# Altium schematic sheet cpu_board.SchDoc
size A3
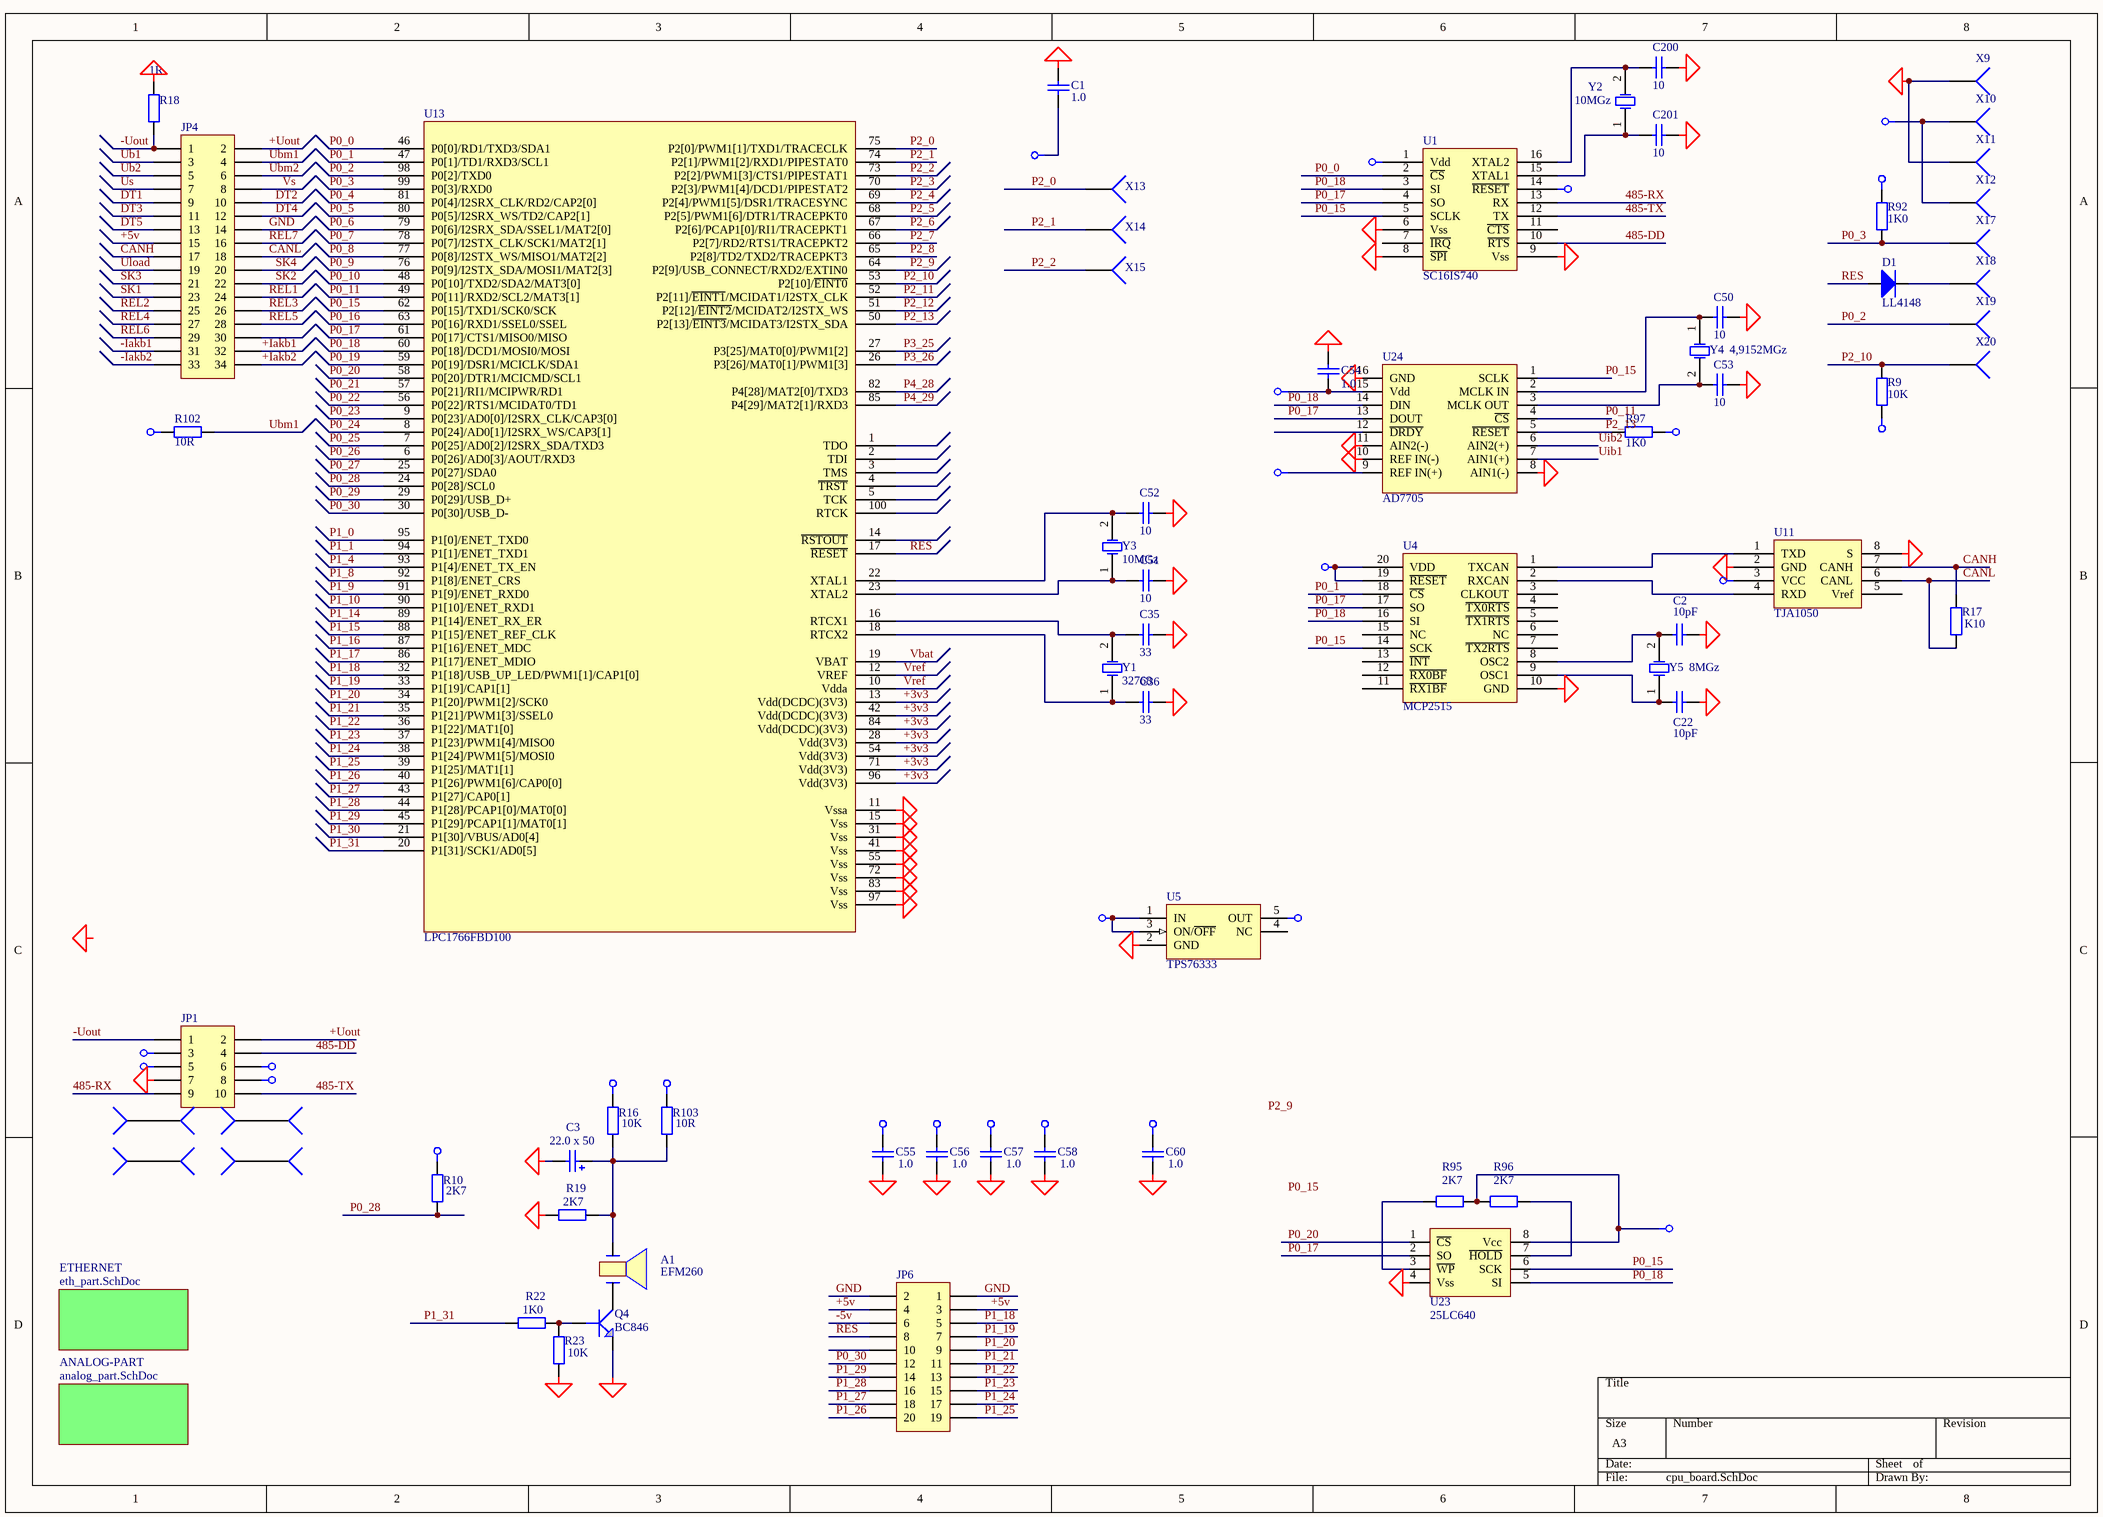
[diagram p0: cpu_board.SchDoc]

## Parts
A1  EFM260  [Pjezo15]
C1  1.0  [_1206]
C2  value 10pF  [_1206]  (hidden comment: Cap Semi)
C3  22.0 x 50  [el3]
C22  value 10pF  [_1206]  (hidden comment: Cap Semi)
C35  33  [_1206]
C36  33  [_1206]
C50  10  [_1206]
C51  10  [_1206]
C52  10  [_1206]
C53  10  [_1206]
C54  1.0  [_1206]
C55  1.0  [_1206]
C56  1.0  [_1206]
C57  1.0  [_1206]
C58  1.0  [_1206]
C60  1.0  [_1206]
C200  10  [_1206]
C201  10  [_1206]
D1  LL4148  [_1206d]
JP1  PBD-10  [HDR2X5]  (value not drawn)
JP4  IDC34  [IDC34M]  (value not drawn)
JP6  PBD-20  [HDR2X10]  (value not drawn)
Q4  BC846  [SO-G3]
R9  10K  [_1206]
R10  2K7  [_1206]
R16  10K  [_1206]
R17  K10  [_1206]
R18  1R  [_1206]
R19  2K7  [_1206]
R22  1K0  [_1206]
R23  10K  [_1206]
R92  1K0  [_1206]
R95  2K7  [_1206]
R96  2K7  [_1206]
R97  1K0  [_1206]
R102  10R  [_1206]
R103  10R  [_1206]
U1  SC16IS740  [TSSO5X6-G16]
U4  MCP2515  [TSSO6X6-G20/D6.6]
U5  TPS76333  [SO-G5/P.95]
U11  TJA1050  [SO-G8/D5]
U13  LPC1766FBD100  [LPC2368]
U23  25LC640  [SO-G8/D5]
U24  AD7705  [SO-G16/D10.4]
X9  (no value)  [PIN1]
X10  (no value)  [PIN1]
X11  (no value)  [PIN1]
X12  (no value)  [PIN1]
X13  (no value)  [PIN1]
X14  (no value)  [PIN1]
X15  (no value)  [PIN1]
X16  (no value)  [PIN1]
X17  (no value)  [PIN1]
X18  (no value)  [PIN1]
X19  (no value)  [PIN1]
X20  (no value)  [PIN1]
X21  (no value)  [PIN1]
X22  (no value)  [PIN1]
X23  (no value)  [PIN1]
X24  (no value)  [PIN1]
X25  (no value)  [PIN1]
X26  (no value)  [PIN1]
X27  (no value)  [PIN1]
Y1  32768  [QWARZ2]
Y2  10MGz  [QWARZ1]
Y3  10MGz  [QWARZ1]
Y4  4,9152MGz  [QWARZ1]
Y5  8MGz  [QWARZ1]

## Sub-sheets
ANALOG-PART = analog_part.SchDoc: no entries
ETHERNET = eth_part.SchDoc: no entries

## Nets
+3v3: C1.1 C58.2 JP1.3 R9.1 R10.2 R92.2 U13.13(Vdd(DCDC)(3V3)) U13.28(Vdd(3V3)) U13.42(Vdd(DCDC)(3V3)) U13.54(Vdd(3V3)) U13.71(Vdd(3V3)) U13.84(Vdd(DCDC)(3V3)) U13.96(Vdd(3V3))
+5v: C54.2 C55.2 C57.2 C60.2 JP1.5 JP4.15 JP6.3 JP6.4 R95.2 R96.1 R97.2 R103.2 U1.1(Vdd) U1.14(~{RESET}) U4.19(~{RESET}) U4.20(VDD) U5.1(IN) U5.3(ON/~{OFF}) U11.3(VCC) U23.8(Vcc) U24.15(Vdd) X10.1 X12.1
+Uout: JP1.2 JP4.2 R16.2 R102.2
-5v: C56.2 JP1.8 JP6.6
GND: C1.2 C2.1 C3.2 C22.1 C35.1 C36.1 C50.1 C51.1 C52.1 C53.1 C54.1 C55.1 C56.1 C57.1 C58.1 C60.1 C200.1 C201.1 JP1.7 JP4.14 JP6.1 JP6.2 Q4.2(E) R18.2 R19.1 R23.1 U1.6(Vss) U1.8(~{SPI}) U1.9(Vss) U4.10(GND) U5.2(GND) U11.2(GND) U11.8(S) U13.11(Vssa) U13.15(Vss) U13.31(Vss) U13.41(Vss) U13.55(Vss) U13.72(Vss) U13.83(Vss) U13.97(Vss) U23.4(Vss) U24.8(AIN1(-)) U24.10(REF_IN(-)) U24.11(AIN2(-)) U24.16(GND) X9.1 X11.1
Vbat: JP1.6 U13.19(VBAT)
Vref: U5.5(OUT) U13.10(Vdda) U13.12(VREF) U24.9(REF_IN(+))
485-DD: JP1.4 U1.10(~{RTS})
485-RX: JP1.9 U1.13(RX)
485-TX: JP1.10 U1.12(TX)
+Iakb1: JP4.32
+Iakb2: JP4.34
-Iakb1: JP4.31
-Iakb2: JP4.33
-Uout: JP1.1 JP4.1 R18.1
CANH: JP4.17 R17.2 U11.7(CANH)
CANL: JP4.18 R17.1 U11.6(CANL)
DT1: JP4.9
DT2: JP4.10
DT3: JP4.11
DT4: JP4.12
DT5: JP4.13
P0_0: U1.2(~{CS}) U13.46(P0[0]/RD1/TXD3/SDA1)
P0_1: U4.18(~{CS}) U13.47(P0[1]/TD1/RXD3/SCL1)
P0_2: U13.98(P0[2]/TXD0) X19.1
P0_3: R92.1 U13.99(P0[3]/RXD0) X17.1
P0_4: U13.81(P0[4]/I2SRX_CLK/RD2/CAP2[0])
P0_5: U13.80(P0[5]/I2SRX_WS/TD2/CAP2[1])
P0_6: U13.79(P0[6]/I2SRX_SDA/SSEL1/MAT2[0])
P0_7: U13.78(P0[7]/I2STX_CLK/SCK1/MAT2[1])
P0_8: U13.77(P0[8]/I2STX_WS/MISO1/MAT2[2])
P0_9: U13.76(P0[9]/I2STX_SDA/MOSI1/MAT2[3])
P0_10: U13.48(P0[10]/TXD2/SDA2/MAT3[0])
P0_11: U13.49(P0[11]/RXD2/SCL2/MAT3[1]) U24.4(~{CS})
P0_15: U1.5(SCLK) U4.14(SCK) U13.62(P0[15]/TXD1/SCK0/SCK) U23.6(SCK) U24.1(SCLK)
P0_16: U13.63(P0[16]/RXD1/SSEL0/SSEL)
P0_17: U1.4(SO) U4.17(SO) U13.61(P0[17]/CTS1/MISO0/MISO) U23.2(SO) U24.13(DOUT)
P0_18: U1.3(SI) U4.16(SI) U13.60(P0[18]/DCD1/MOSI0/MOSI) U23.5(SI) U24.14(DIN)
P0_19: U13.59(P0[19]/DSR1/MCICLK/SDA1)
P0_20: U13.58(P0[20]/DTR1/MCICMD/SCL1) U23.1(~{CS})
P0_21: U13.57(P0[21]/RI1/MCIPWR/RD1)
P0_22: U13.56(P0[22]/RTS1/MCIDAT0/TD1)
P0_23: U13.9(P0[23]/AD0[0]/I2SRX_CLK/CAP3[0])
P0_24: U13.8(P0[24]/AD0[1]/I2SRX_WS/CAP3[1])
P0_25: U13.7(P0[25]/AD0[2]/I2SRX_SDA/TXD3)
P0_26: U13.6(P0[26]/AD0[3]/AOUT/RXD3)
P0_27: U13.25(P0[27]/SDA0)
P0_28: R10.1 U13.24(P0[28]/SCL0)
P0_29: U13.29(P0[29]/USB_D+)
P0_30: JP6.12 U13.30(P0[30]/USB_D-)
P1_0: U13.95(P1[0]/ENET_TXD0)
P1_1: U13.94(P1[1]/ENET_TXD1)
P1_4: U13.93(P1[4]/ENET_TX_EN)
P1_8: U13.92(P1[8]/ENET_CRS)
P1_9: U13.91(P1[9]/ENET_RXD0)
P1_10: U13.90(P1[10]/ENET_RXD1)
P1_14: U13.89(P1[14]/ENET_RX_ER)
P1_15: U13.88(P1[15]/ENET_REF_CLK)
P1_16: U13.87(P1[16]/ENET_MDC)
P1_17: U13.86(P1[17]/ENET_MDIO)
P1_18: JP6.5 U13.32(P1[18]/USB_UP_LED/PWM1[1]/CAP1[0])
P1_19: JP6.7 U13.33(P1[19]/CAP1[1])
P1_20: JP6.9 U13.34(P1[20]/PWM1[2]/SCK0)
P1_21: JP6.11 U13.35(P1[21]/PWM1[3]/SSEL0)
P1_22: JP6.13 U13.36(P1[22]/MAT1[0])
P1_23: JP6.15 U13.37(P1[23]/PWM1[4]/MISO0)
P1_24: JP6.17 U13.38(P1[24]/PWM1[5]/MOSI0)
P1_25: JP6.19 U13.39(P1[25]/MAT1[1])
P1_26: JP6.20 U13.40(P1[26]/PWM1[6]/CAP0[0])
P1_27: JP6.18 U13.43(P1[27]/CAP0[1])
P1_28: JP6.16 U13.44(P1[28]/PCAP1[0]/MAT0[0])
P1_29: JP6.14 U13.45(P1[29]/PCAP1[1]/MAT0[1])
P1_30: U13.21(P1[30]/VBUS/AD0[4])
P1_31: R22.1 U13.20(P1[31]/SCK1/AD0[5])
P2_0: U13.75(P2[0]/PWM1[1]/TXD1/TRACECLK) X13.1
P2_1: U13.74(P2[1]/PWM1[2]/RXD1/PIPESTAT0) X14.1
P2_2: U13.73(P2[2]/PWM1[3]/CTS1/PIPESTAT1) X15.1
P2_3: U13.70(P2[3]/PWM1[4]/DCD1/PIPESTAT2)
P2_4: U13.69(P2[4]/PWM1[5]/DSR1/TRACESYNC)
P2_5: U13.68(P2[5]/PWM1[6]/DTR1/TRACEPKT0)
P2_6: U13.67(P2[6]/PCAP1[0]/RI1/TRACEPKT1)
P2_7: U13.66(P2[7]/RD2/RTS1/TRACEPKT2)
P2_8: U13.65(P2[8]/TD2/TXD2/TRACEPKT3)
P2_9: U13.64(P2[9]/USB_CONNECT/RXD2/EXTIN0)
P2_10: R9.2 U13.53(P2[10]/~{EINT0}) X20.1
P2_11: U13.52(P2[11]/~{EINT1}/MCIDAT1/I2STX_CLK)
P2_12: U13.51(P2[12]/~{EINT2}/MCIDAT2/I2STX_WS)
P2_13: R97.1 U13.50(P2[13]/~{EINT3}/MCIDAT3/I2STX_SDA) U24.5(~{RESET})
P3_25: U13.27(P3[25]/MAT0[0]/PWM1[2])
P3_26: U13.26(P3[26]/MAT0[1]/PWM1[3])
P4_28: U13.82(P4[28]/MAT2[0]/TXD3)
P4_29: U13.85(P4[29]/MAT2[1]/RXD3)
REL1: JP4.24
REL2: JP4.25
REL3: JP4.26
REL4: JP4.27
REL5: JP4.28
REL6: JP4.29
REL7: JP4.16
RES: D1.1(A) JP6.8 U13.17(~{RESET})
SK1: JP4.23
SK2: JP4.22
SK3: JP4.21
SK4: JP4.20
Ub1: JP4.3
Ub2: JP4.5
Ubm1: JP4.4 R102.1
Ubm2: JP4.6
Uib1: U24.7(AIN1(+))
Uib2: U24.6(AIN2(+))
Uload: JP4.19
Us: JP4.7
Vs: JP4.8
NetA1_1: A1.1 Q4.3(C)
NetA1_2: A1.2 C3.1 R16.1 R19.2 R103.1
NetC2_2: C2.2 U4.8(OSC2) Y5.2(OSC2)
NetC22_2: C22.2 U4.9(OSC1) Y5.1(OSC1)
NetC35_2: C35.2 U13.16(RTCX1) Y1.2(OSC2)
NetC36_2: C36.2 U13.18(RTCX2) Y1.1(OSC1)
NetC50_2: C50.2 U24.2(MCLK_IN) Y4.1(OSC1)
NetC51_2: C51.2 U13.23(XTAL2) Y3.1(OSC1)
NetC52_2: C52.2 U13.22(XTAL1) Y3.2(OSC2)
NetC53_2: C53.2 U24.3(MCLK_OUT) Y4.2(OSC2)
NetC200_2: C200.2 U1.16(XTAL2) Y2.2(OSC2)
NetC201_2: C201.2 U1.15(XTAL1) Y2.1(OSC1)
NetD1_2: D1.2(K) X18.1
NetQ4_1: Q4.1(B) R22.2 R23.2
NetR95_1: R95.1 U23.3(~{WP})
NetR96_2: R96.2 U23.7(~{HOLD})
NetU4_1: U4.1(TXCAN) U11.1(TXD)
NetU4_2: U4.2(RXCAN) U11.4(RXD)
NetX16_1: X16.1 X22.1
NetX21_1: X21.1 X23.1
NetX24_1: X24.1 X26.1
NetX25_1: X25.1 X27.1

Not connected (* = marked no-connect by the designer): JP4 30; JP6 10; U1 7(~{IRQ}) 11(~{CTS}); U4 3(CLKOUT) 4(~{TX0RTS}) 5(~{TX1RTS}) 6(NC) 7(~{TX2RTS}) 11(~{RX1BF}) 12(~{RX0BF}) 13(~{INT}) 15(NC); U5 4(NC); U11 5(Vref); U13 1(TDO) 2(TDI) 3(TMS) 4(~{TRST}) 5(TCK) 14(~{RSTOUT}) 100(RTCK); U24 12(~{DRDY})

## Notes on the sheet
- Labels drawn without touching a wire or pin: GND, P0_15, P2_9

## Library data of the parts
A1 = PJEZ0: Beeper; Value: EFM260
C1 C54 = Cap Semi: Capacitor; Manufacturer: Generic Components; Class I: Passive; Value: 1,0; Published: 8-Jun-2000; Revision: July-2002: Re-released for DXP Platform.; Publisher: Altium Limited; Class II: Capacitor
C2 C22 = Cap Semi: Capacitor (Semiconductor SIM Model); Manufacturer: Generic Components; Class I: Passive; Published: 8-Jun-2000; Revision: July-2002: Re-released for DXP Platform.; Publisher: Altium Limited; Class II: Capacitor
C3 = Cap Pol1: Polarized Capacitor (Radial); Manufacturer: Generic Components; Class I: Passive; Value: 22,0x50; Published: 8-Jun-2000; Revision: July-2002: Re-released for DXP Platform.; Publisher: Altium Limited; Class II: Capacitor
C35 C36 = Cap Semi: Capacitor (Semiconductor SIM Model); Manufacturer: Generic Components; Class I: Passive; Value: 15pF; Published: 8-Jun-2000; Revision: July-2002: Re-released for DXP Platform.; Publisher: Altium Limited; Class II: Capacitor
C50-C53 C200 C201 = Cap Semi: Capacitor; Manufacturer: Generic Components; Class I: Passive; Value: 15pF; Published: 8-Jun-2000; Revision: July-2002: Re-released for DXP Platform.; Publisher: Altium Limited; Class II: Capacitor
C55-C58 C60 = Cap Semi: Capacitor; Manufacturer: Generic Components; Class I: Passive; Value: 0,1; Published: 8-Jun-2000; Revision: July-2002: Re-released for DXP Platform.; Publisher: Altium Limited; Class II: Capacitor
D1 = Diode: Manufacturer: Generic Components; Class I: Discrete; Class II: Diode - Switching; Published: 8-Jun-2000; Revision: July-2002: Re-released for DXP Platform.; Publisher: Altium Limited; Value: LL4148
JP1 = Header 5X2: Header, 5-Pin, Dual row; Manufacturer: Generic Components; Class I: Connector; Revision: July-2002: Re-released for DXP Platform.; Publisher: Altium Limited
JP4 = Header 17X2: Header, 17-Pin, Dual row; Manufacturer: Generic Components; Class I: Connector; Revision: July-2002: Re-released for DXP Platform.; Publisher: Altium Limited
JP6 = Header 10X2: Header, 10-Pin, Dual row; Manufacturer: Generic Components; Class I: Connector; Revision: July-2002: Re-released for DXP Platform.; Publisher: Altium Limited
Q4 = GT122: Bipolar transistor; Right: 20; Bottom: 20; Value: BC846
R9 R16 R18 R19 R22 R92 R95 R96 = Res2: Resistor; Manufacturer: Generic Components; Class I: Passive; Rule: Undefined; Published: 8-Jun-2000; Revision: July-2002: Re-released for DXP Platform.; Publisher: Altium Limited; Class II: Resistor
  R9 R16: Value: 10K
  R18: Value: 1R
  R19 R95 R96: Value: 2K7
  R22 R92: Value: 1K0
R10 R102 R103 = Res2: Resistor; Manufacturer: Generic Components; Class I: Passive; Value: 10K; Rule: Undefined; Published: 8-Jun-2000; Revision: July-2002: Re-released for DXP Platform.; Publisher: Altium Limited; Class II: Resistor
R17 = Res2: Resistor; Manufacturer: Generic Components; Class I: Passive; Value: 120; Published: 8-Jun-2000; Revision: July-2002: Re-released for DXP Platform.; Publisher: Altium Limited; Class II: Resistor
R23 = Res2: Resistor; Manufacturer: Generic Components; Class I: Passive; Published: 8-Jun-2000; Revision: July-2002: Re-released for DXP Platform.; Publisher: Altium Limited; Class II: Resistor; Value: 10K
R97 = Res2: Resistor; Manufacturer: Generic Components; Class I: Passive; Value: 1K; Published: 8-Jun-2000; Revision: July-2002: Re-released for DXP Platform.; Publisher: Altium Limited; Class II: Resistor
U5 = LP2980AIM5-3.3: Voltage Regulator; Manufacturer: National Semiconductor; Package Information: Latest Revision: Aug-1999; Class I: Power Management; Published: 15-Apr-2002; Datasheet: Latest Revision: Oct-1999; Package Reference: MA05B; Publisher: Altium Limited; Class II: Voltage Regulator; Value: TPS76333
U13 = LPC2368FBD100
U23 = 25LC640: Memory; Value: 26LC640
U24 = AD7705: ADC; Value: AD7705
X9-X27 = Socket: Manufacturer: Generic Components; Class I: Connector; Revision: July-2002: Re-released for DXP Platform.; Publisher: Altium Limited
Y1-Y5 = XTAL: Crystal Oscillator; Manufacturer: Generic Components; Published: 8-Jun-2000; Revision: July-2002: Re-released for DXP Platform.; Publisher: Altium Limited; Class I: Oscillator; Class II: Crystal Oscillator
  Y2 Y3: Value: 10MGz
  Y4: Value: 4,9152MGz